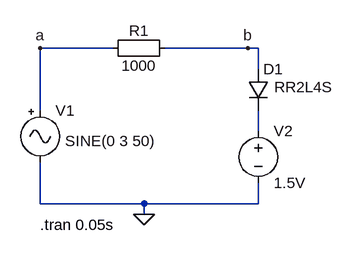
[diagram p0: schematic LD-REG-1.asc]
LD-REG-1.asc, the LTspice schematic file:
Version 4
SHEET 1 880 680
WIRE 0 96 -112 96
WIRE 208 96 80 96
WIRE 224 96 208 96
WIRE 224 128 224 96
WIRE -112 192 -112 96
WIRE 224 224 224 192
WIRE -112 336 -112 272
WIRE 48 336 -112 336
WIRE 224 336 224 304
WIRE 224 336 48 336
WIRE 48 352 48 336
FLAG -112 96 a
FLAG 208 96 b
FLAG 48 352 0
SYMBOL diode 208 128 R0
WINDOW 3 41 28 Left 2
SYMATTR Value RR2L4S
SYMATTR InstName D1
SYMBOL Misc\\signal -112 176 R0
WINDOW 123 0 0 Left 2
WINDOW 39 0 0 Left 2
WINDOW 3 38 63 Left 2
SYMATTR Value SINE(0 3 50)
SYMATTR InstName V1
SYMBOL Misc\\EuropeanResistor 96 80 R90
WINDOW 0 5 56 VBottom 2
WINDOW 3 27 56 VTop 2
SYMATTR InstName R1
SYMATTR Value 1000
SYMBOL voltage 224 208 R0
SYMATTR InstName V2
SYMATTR Value 1.5V
TEXT -112 368 Left 2 !.tran 0.05s

The netlist it stands for:
* LD-REG-1.asc
D1 b N001 RR2L4S
V1 a 0 SINE(0 3 50)
R1 b a 1000
V2 N001 0 1.5V
.model D D
.lib standard.dio
.tran 0.05s
.backanno
.end